# EAGLE design Layer2_v1.0 (EAGLE 6.2)
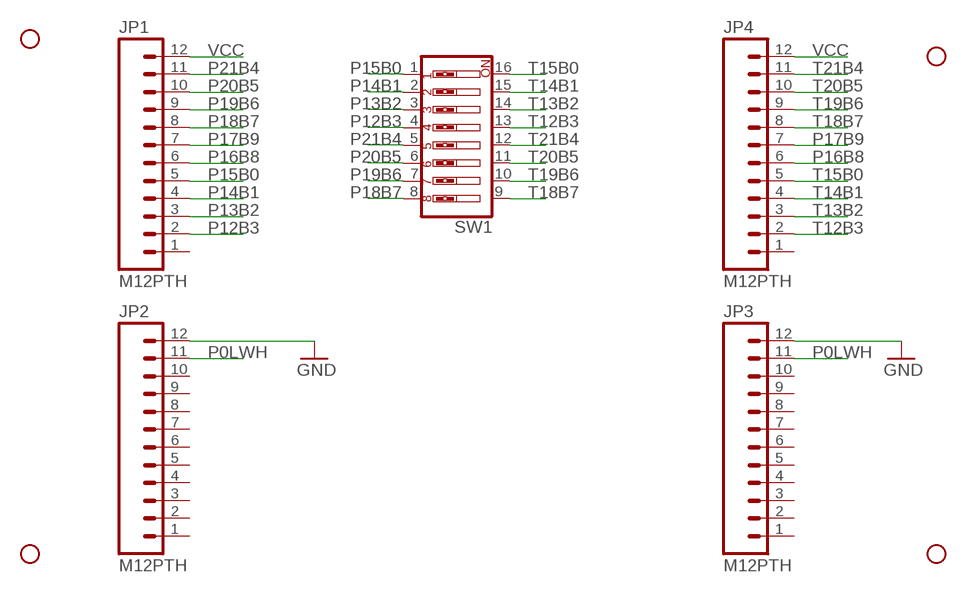
[diagram p0: schematic, sheet 1]

## Parts
JP1  M12PTH  [1X12]
JP2  M12PTH  [1X12]
JP3  M12PTH  [1X12]
JP4  M12PTH  [1X12]
JP5  STAND-OFF  [STAND-OFF]
JP6  STAND-OFF  [STAND-OFF]
JP7  STAND-OFF  [STAND-OFF]
JP8  STAND-OFF  [STAND-OFF]
SW1  SW_DIP-8  [DIPSWITCH-08]

## Nets
GND: JP2.12 JP3.12
P0LWH: JP2.11 JP3.11
P12B3: JP1.2 SW1.4
P13B2: JP1.3 SW1.3
P14B1: JP1.4 SW1.2
P15B0: JP1.5 SW1.1
P16B8: JP1.6 JP4.6
P17B9: JP1.7 JP4.7
P18B7: JP1.8 SW1.8
P19B6: JP1.9 SW1.7
P20B5: JP1.10 SW1.6
P21B4: JP1.11 SW1.5
T12B3: JP4.2 SW1.13
T13B2: JP4.3 SW1.14
T14B1: JP4.4 SW1.15
T15B0: JP4.5 SW1.16
T18B7: JP4.8 SW1.9
T19B6: JP4.9 SW1.10
T20B5: JP4.10 SW1.11
T21B4: JP4.11 SW1.12
VCC: JP1.12 JP4.12
Unconnected: JP1.1 JP2.1 JP2.2 JP2.3 JP2.4 JP2.5 JP2.6 JP2.7 JP2.8 JP2.9 JP2.10 JP3.1 JP3.2 JP3.3 JP3.4 JP3.5 JP3.6 JP3.7 JP3.8 JP3.9 JP3.10 JP4.1

## Library data of the parts
JP1-JP4 = SparkFun-Connectors:M12: Header 12 Standard 12-pin 0.1" header. Use with straight break away headers (SKU : PRT-00116), right angle break away headers (PRT-00553), swiss pins (PRT-00743), machine pins (PRT-00117), and female headers (PRT-00115).
JP5-JP8 = SparkFun-Electromechanical:STAND-OFF: #4 Stand Off This is the mechanical footprint for a #4 phillips button head screw. Use the keepout ring to avoid running the screw head into surrounding components. SKU : PRT-00447
SW1 = SparkFun-Electromechanical:SW_DIP-8: DIP Switch 8 Position Spark Fun Electronics SKU : COM-08034

## Board
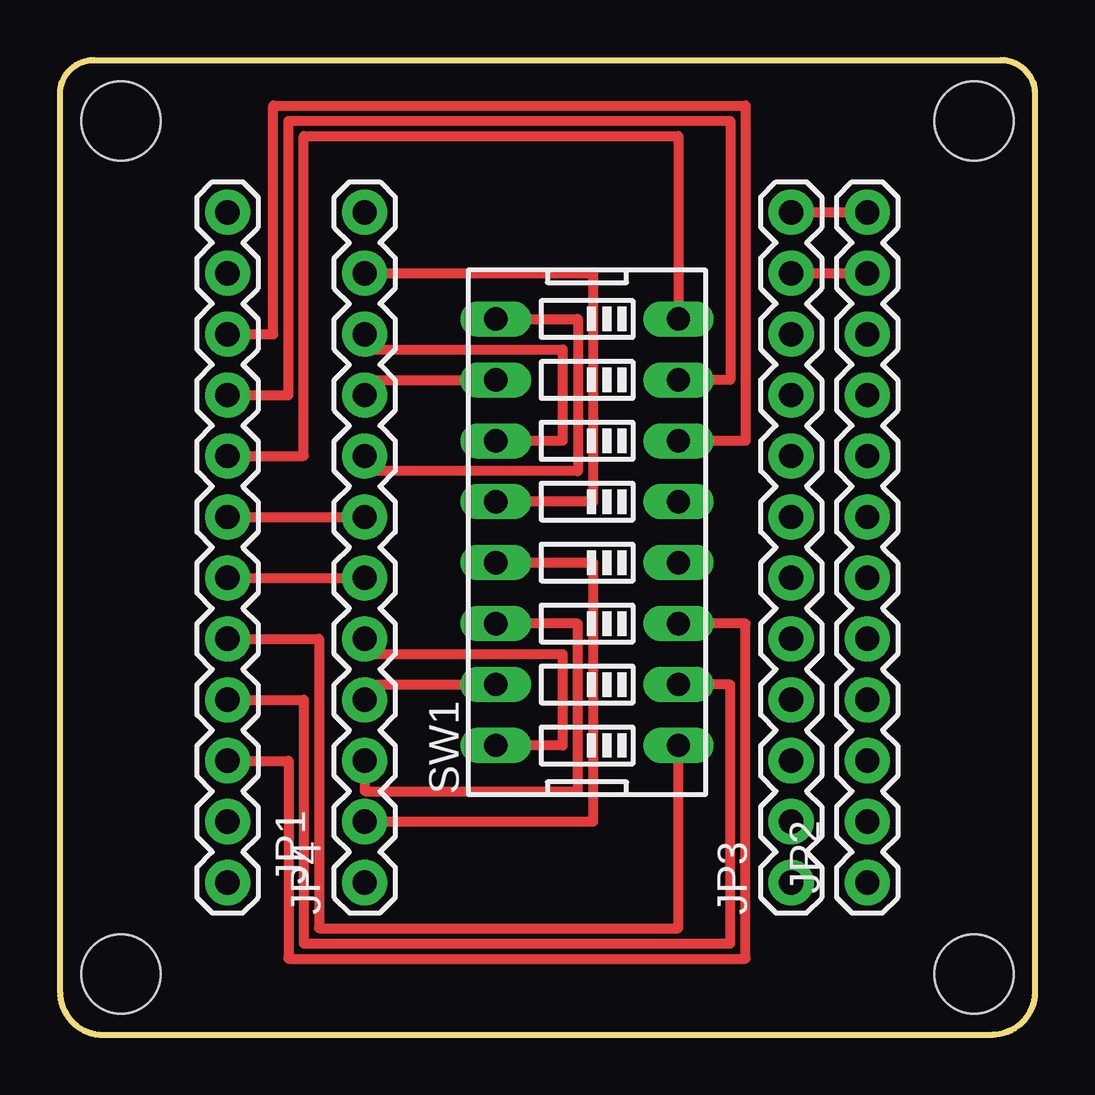
[diagram p1: board, top side]
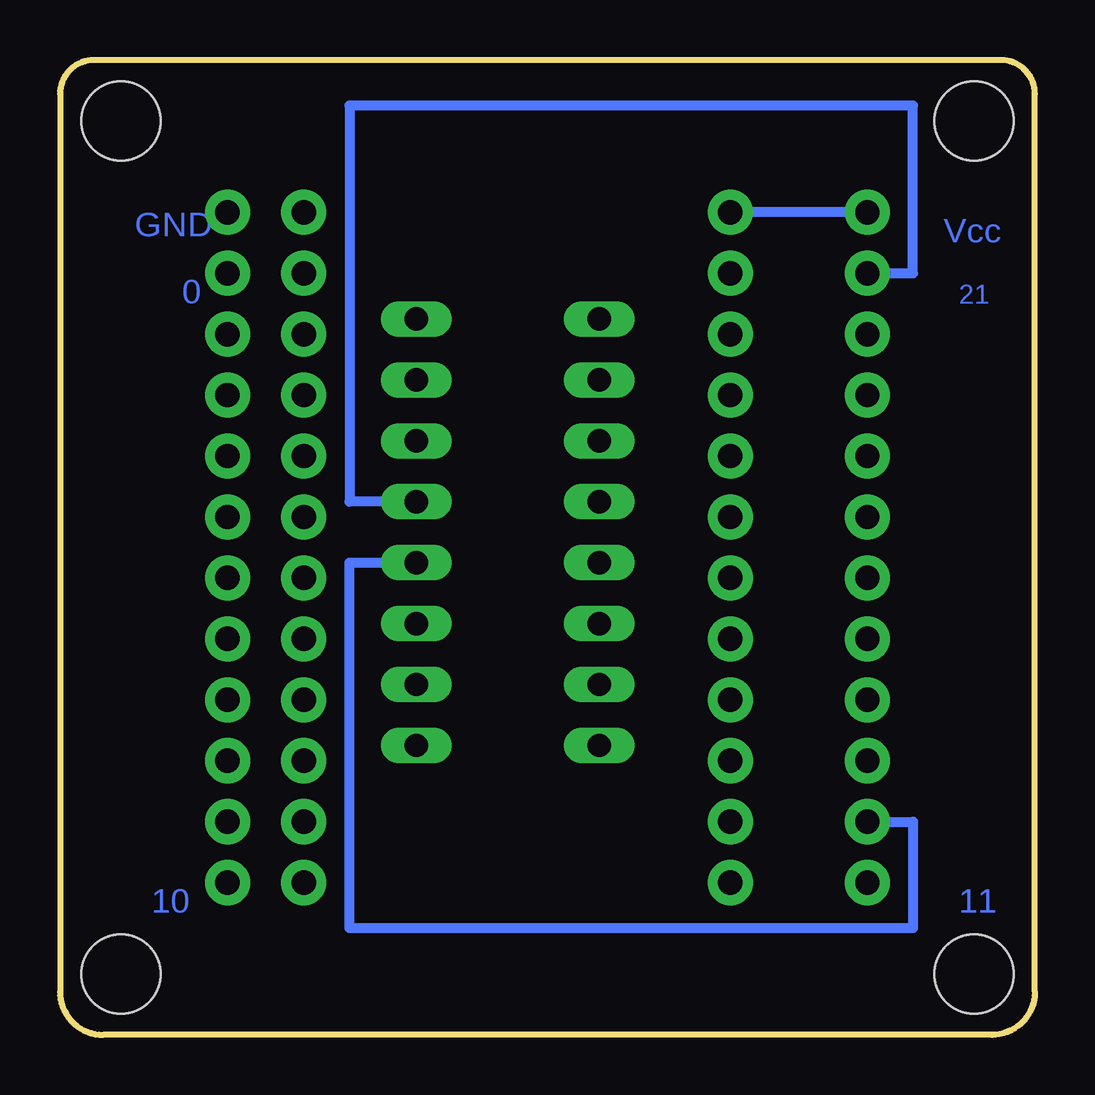
[diagram p2: board, bottom side, seen from below]

Size 40.64 x 40.64 mm. Coordinates in mm from the lower left corner, seen from the top.
Outline: 0,1.8 0,39.22 arc-90 1.42,40.64 39.22,40.64 arc-90 40.64,39.22 40.64,1.8 arc-90 38.84,0 1.8,0 arc-90 0,1.8
Copper layers (1*16): Top 0.035mm / dielectric 1.5mm / Bottom 0.035mm
Design rules: minimum track width 6mil, minimum drill 24mil, track to track 8mil, track to pad 8mil, pad to pad 8mil, via to via 8mil, smd to smd 8mil, copper to edge 40mil, drill to drill 8mil, minimum pad ring 10mil, minimum via ring 8mil, stop-mask expansion 4mil, vias tented up to drill 0mil, thermal gap 10mil

### Footprints (pad centres in the part's own frame; a part is rotated, then mirrored left to right if it is on the bottom)
1X12 = drill 1.016 pad 1.88: 1 0,0; 2 2.54,0; 3 5.08,0; 4 7.62,0; 5 10.16,0; 6 12.7,0; 7 15.24,0; 8 17.78,0; 9 20.32,0; 10 22.86,0; 11 25.4,0; 12 27.94,0
STAND-OFF = hole 3.302: 0,0
DIPSWITCH-08 = drill 0.97 long: 1 -8.89,-3.81; 2 -6.35,-3.81; 3 -3.81,-3.81; 4 -1.27,-3.81; 5 1.27,-3.81; 6 3.81,-3.81; 7 6.35,-3.81; 8 8.89,-3.81; 9 8.89,3.81; 10 6.35,3.81; 11 3.81,3.81; 12 1.27,3.81; 13 -1.27,3.81; 14 -3.81,3.81; 15 -6.35,3.81; 16 -8.89,3.81

### Placement (x,y rotation side)
JP1  6.99,6.35 90 top
JP2  33.66,6.35 90 top
JP3  30.48,6.35 90 top
JP4  12.7,6.35 90 top
JP5  2.54,38.1 0 top
JP6  38.1,38.1 0 top
JP7  38.1,2.54 0 top
JP8  2.54,2.54 0 top
SW1  21.97,20.95 90 top

### Tracks (layer width: path | path; a pad name or v marks a point on that pad's centre or on a via)
GND
  Top 0.406: JP3.12 JP2.12
P0LWH
  Top 0.406: JP3.11 JP2.11
P12B3
  Bottom 0.406: JP1.2 5.08,8.89 5.08,4.45 28.57,4.45 28.57,19.68 SW1.4
P13B2
  Top 0.406: JP1.3 9.53,11.43 9.53,3.17 28.57,3.17 28.57,17.14 SW1.3
P14B1
  Top 0.406: JP1.4 10.16,13.97 10.16,3.81 27.94,3.81 27.94,14.61 SW1.2
P15B0
  Top 0.406: JP1.5 10.79,16.51 10.79,4.45 25.78,4.45 SW1.1
P16B8
  Top 0.406: JP1.6 JP4.6
P17B9
  Top 0.406: JP1.7 JP4.7
P18B7
  Top 0.406: JP1.8 10.16,24.13 10.16,37.47 25.78,37.47 SW1.8
P19B6
  Top 0.406: JP1.9 9.53,26.67 9.53,38.1 27.94,38.1 27.94,27.3 SW1.7
P20B5
  Top 0.406: JP1.10 8.89,29.21 8.89,38.73 28.57,38.73 28.57,24.77 SW1.6
P21B4
  Bottom 0.406: JP1.11 5.08,31.75 5.08,38.73 28.57,38.73 28.57,22.23 SW1.5
T12B3
  Top 0.406: SW1.13 22.23,19.68 22.23,8.89 JP4.2
T13B2
  Top 0.406: JP4.3 12.7,10.16 21.59,10.16 21.59,17.14 SW1.14
T14B1
  Top 0.406: JP4.4 12.7,14.61 SW1.15
T15B0
  Top 0.406: JP4.5 12.7,15.88 20.95,15.88 20.95,12.06 SW1.16
T18B7
  Top 0.406: SW1.9 21.59,29.84 21.59,23.5 12.7,23.5 JP4.8
T19B6
  Top 0.406: JP4.9 12.7,27.3 SW1.10
T20B5
  Top 0.406: JP4.10 12.7,28.57 20.95,28.57 20.95,24.77 SW1.11
T21B4
  Top 0.406: JP4.11 22.23,31.75 22.23,22.23 SW1.12
VCC
  Bottom 0.406: JP1.12 JP4.12

### Text on the board
Bottom: GND | Vcc | 21 | 0 | 11 | 10